# EAGLE design payloaduplink (EAGLE 9.6.2)

## Sheet 1 of 2
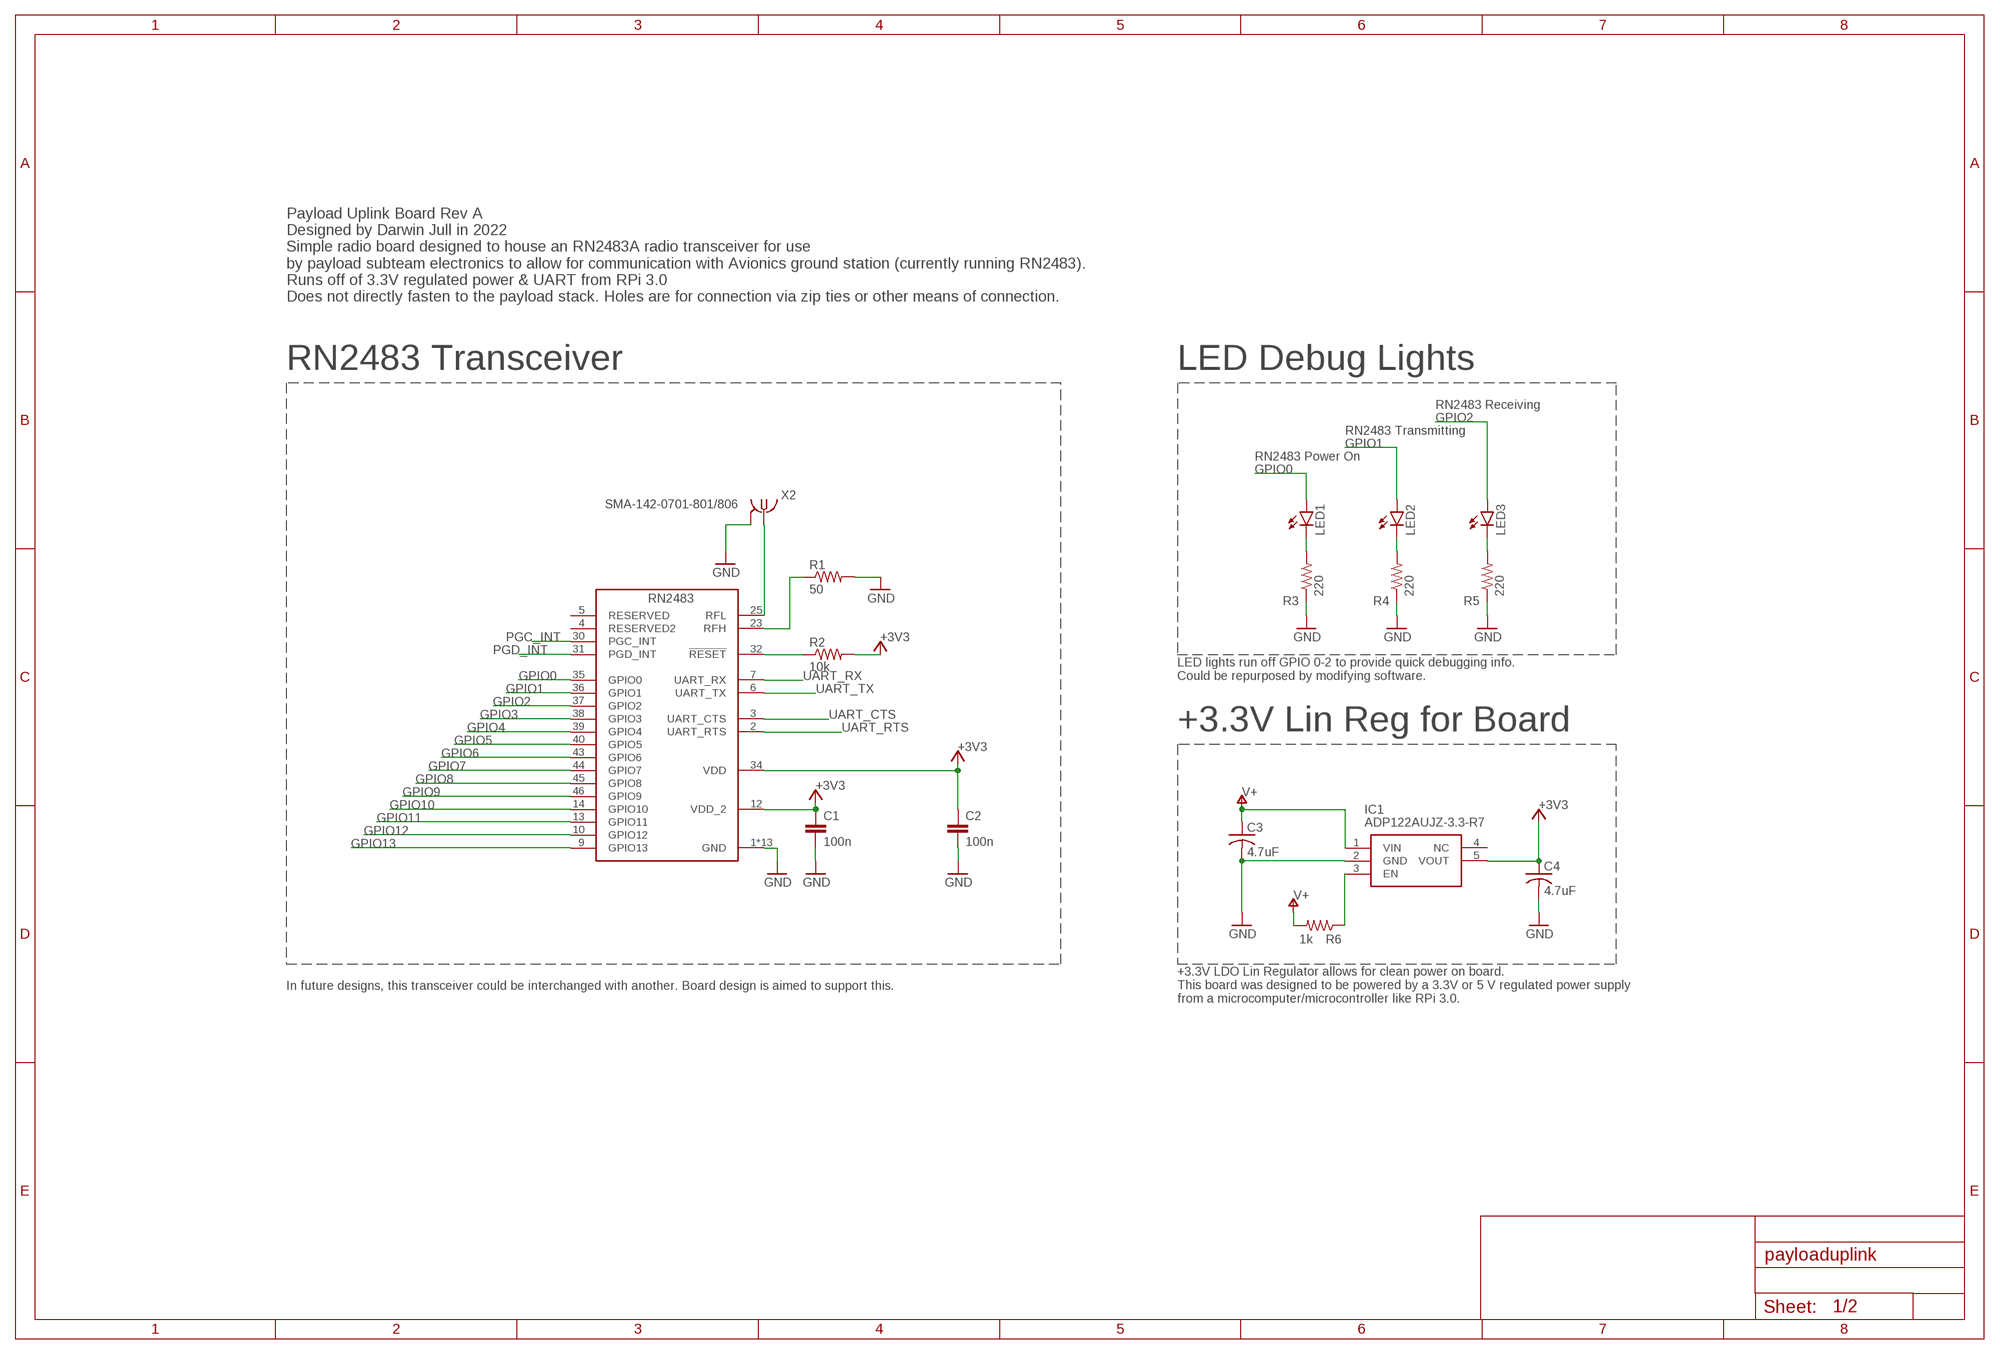
[diagram p0: schematic, sheet 1]

### Parts
C1  100n  C-EUC0805  [C0805]
C2  100n  C-EUC0805  [C0805]
C3  4.7uF  C-USC0805  [C0805]
C4  4.7uF  C-USC0805  [C0805]
IC1  ADP122AUJZ-3.3-R7  [SOT95P280X100-5N]
LED1  LEDCHIPLED_0603  [CHIPLED_0603]
LED2  LEDCHIPLED_0603  [CHIPLED_0603]
LED3  LEDCHIPLED_0603  [CHIPLED_0603]
R1  50  R-US_R0402  [R0402]
R2  10k  R-US_R0805  [R0805]
R3  220  R-US_R0805  [R0805]
R4  220  R-US_R0805  [R0805]
R5  220  R-US_R0805  [R0805]
R6  1k  R-US_R0805  [R0805]
U$1  RN2483_TRANSCIEVER  [RN2483]
X2  SMA-142-0701-801/806  [J502-ND-142-0701-801/806]

### Nets
+3V3 [PWR]: C1.1 C2.1 C4.1 IC1.5(VOUT) R2.2 U$1.12(VDD_2) U$1.34(VDD)
GND [GND]: C1.2 C2.2 C3.2 C4.2 IC1.2(GND) R1.2 R3.1 R4.1 R5.1 U$1.1(GND) U$1.8(GND) U$1.11(GND) U$1.20(GND) U$1.21(GND) U$1.22(GND) U$1.24(GND) U$1.26(GND) U$1.27(GND) U$1.28(GND) U$1.33(GND) U$1.41(GND) U$1.47(GND) X2.G@1 X2.G@2 X2.G@3 X2.G@4 ; also sheet 2
GPIO0 [DATA]: LED1.A U$1.35(GPIO0)
GPIO1 [DATA]: LED2.A U$1.36(GPIO1)
GPIO2 [DATA]: LED3.A U$1.37(GPIO2)
GPIO3 [DATA]: U$1.38(GPIO3) ; also sheet 2
GPIO4 [DATA]: U$1.39(GPIO4) ; also sheet 2
GPIO5 [DATA]: U$1.40(GPIO5) ; also sheet 2
GPIO6 [DATA]: U$1.43(GPIO6) ; also sheet 2
GPIO7 [DATA]: U$1.44(GPIO7) ; also sheet 2
GPIO8 [DATA]: U$1.45(GPIO8) ; also sheet 2
GPIO9 [DATA]: U$1.46(GPIO9) ; also sheet 2
GPIO10 [DATA]: U$1.14(GPIO10) ; also sheet 2
GPIO11 [DATA]: U$1.13(GPIO11) ; also sheet 2
GPIO12 [DATA]: U$1.10(GPIO12) ; also sheet 2
GPIO13 [DATA]: U$1.9(GPIO13) ; also sheet 2
N$1 [ANT]: U$1.25(RFL) X2.1
N$2 [ANT]: R1.1 U$1.23(RFH)
N$3 [DATA]: LED1.C R3.2
N$4 [DATA]: LED2.C R4.2
N$5 [DATA]: LED3.C R5.2
N$7 [DATA]: R2.1 U$1.32(!RESET)
N$8: IC1.3(EN) R6.1
PGC_INT [DATA]: U$1.30(PGC_INT) ; also sheet 2
PGD_INT [DATA]: U$1.31(PGD_INT) ; also sheet 2
UART_CTS [DATA]: U$1.3(UART_CTS) ; also sheet 2
UART_RTS [DATA]: U$1.2(UART_RTS) ; also sheet 2
UART_RX [DATA]: U$1.7(UART_RX) ; also sheet 2
UART_TX [DATA]: U$1.6(UART_TX) ; also sheet 2
V+: C3.1 IC1.1(VIN) R6.2 ; also sheet 2
Unconnected: IC1.4(NC) U$1.4(RESERVED2) U$1.5(RESERVED)

### Notes on the sheet
- Payload Uplink Board Rev A
  Designed by Darwin Jull in 2022
  Simple radio board designed to house an RN2483A radio transceiver for use
  by payload subteam electronics to allow for communication with Avionics ground station (currently running RN2483). 
  Runs off of 3.3V regulated power & UART from RPi 3.0
  Does not directly fasten to the payload stack. Holes are for connection via zip ties or other means of connection.
- RN2483 Transceiver | LED Debug Lights
- RN2483 Receiving
- RN2483 Transmitting
- RN2483 Power On
- LED lights run off GPIO 0-2 to provide quick debugging info. 
  Could be repurposed by modifying software.
- +3.3V Lin Reg for Board
- In future designs, this transceiver could be interchanged with another. Board design is aimed to support this.
- +3.3V LDO Lin Regulator allows for clean power on board. 
  This board was designed to be powered by a 3.3V or 5 V regulated power supply
  from a microcomputer/microcontroller like RPi 3.0.

## Sheet 2 of 2
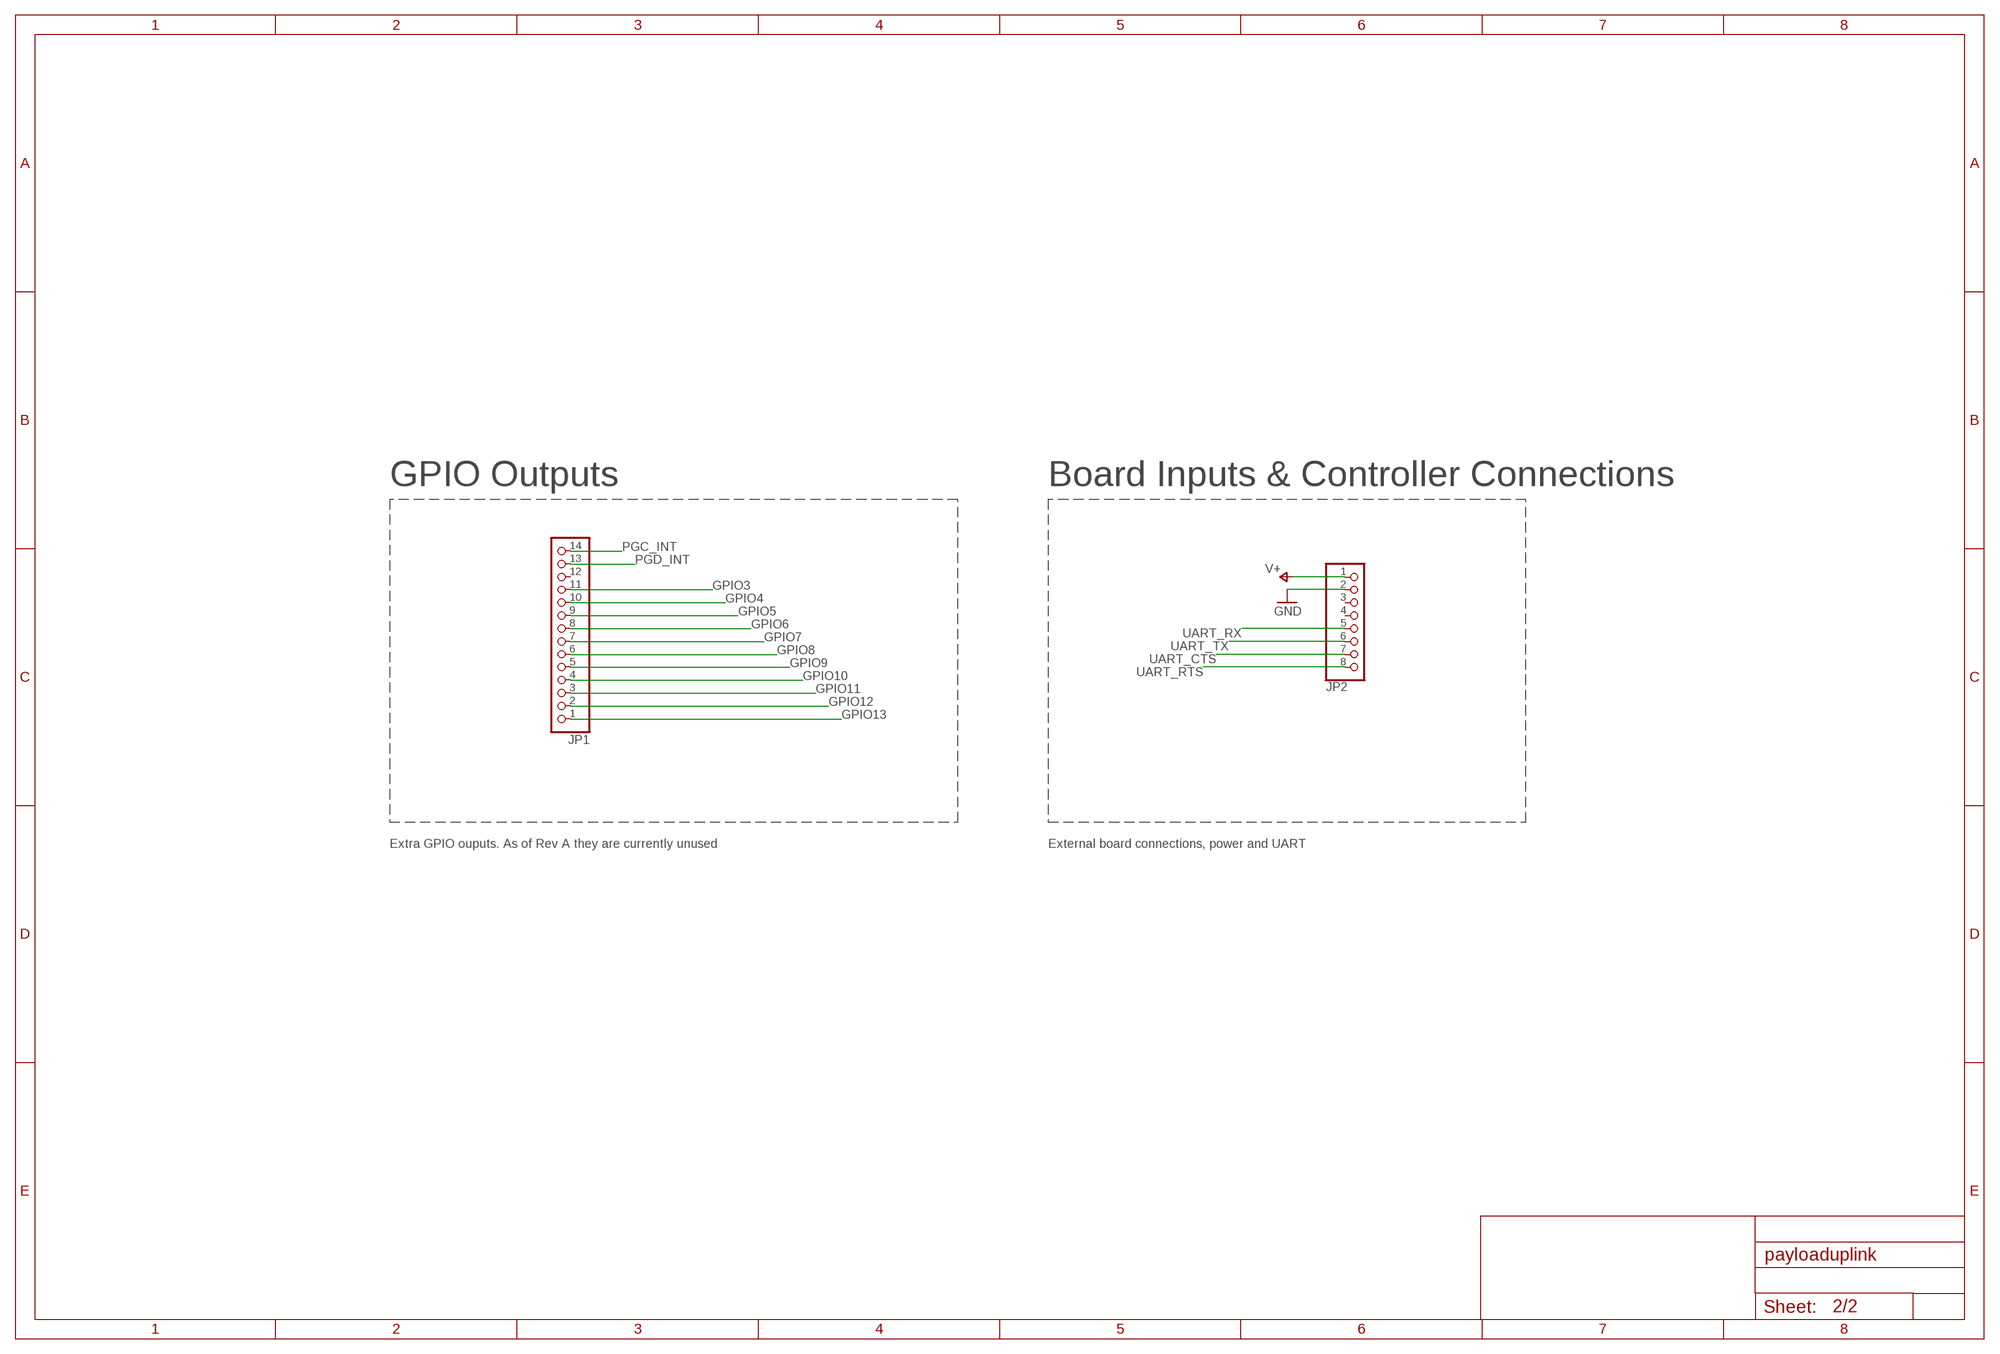
[diagram p1: schematic, sheet 2]

### Parts
JP1  PINHD-1X14  [1X14]
JP2  PINHD-1X8  [1X08]

### Nets
GND [GND]: JP2.2 ; also sheet 1
GPIO3 [DATA]: JP1.11 ; also sheet 1
GPIO4 [DATA]: JP1.10 ; also sheet 1
GPIO5 [DATA]: JP1.9 ; also sheet 1
GPIO6 [DATA]: JP1.8 ; also sheet 1
GPIO7 [DATA]: JP1.7 ; also sheet 1
GPIO8 [DATA]: JP1.6 ; also sheet 1
GPIO9 [DATA]: JP1.5 ; also sheet 1
GPIO10 [DATA]: JP1.4 ; also sheet 1
GPIO11 [DATA]: JP1.3 ; also sheet 1
GPIO12 [DATA]: JP1.2 ; also sheet 1
GPIO13 [DATA]: JP1.1 ; also sheet 1
PGC_INT [DATA]: JP1.14 ; also sheet 1
PGD_INT [DATA]: JP1.13 ; also sheet 1
UART_CTS [DATA]: JP2.7 ; also sheet 1
UART_RTS [DATA]: JP2.8 ; also sheet 1
UART_RX [DATA]: JP2.5 ; also sheet 1
UART_TX [DATA]: JP2.6 ; also sheet 1
V+: JP2.1 ; also sheet 1
Unconnected: JP1.12 JP2.3 JP2.4

### Notes on the sheet
- GPIO Outputs | Board Inputs & Controller Connections
- Extra GPIO ouputs. As of Rev A they are currently unused | External board connections, power and UART

## Library data of the parts
C1 C2 = rcl:C-EU: CAPACITOR, European symbol; SPICEPREFIX: C
C3 C4 = rcl:C-US: CAPACITOR, American symbol; SPICEPREFIX: C
IC1 = ADP122AUJZ-3.3-R7:ADP122AUJZ-3.3-R7: Linear Voltage Regulators 5.5V Input 300mA Low Quiescent Crnt CMOS Source: Datasheet <http://www.analog.com/media/en/technical-documentation/data-sheets/ADP122_123.pdf>; DESCRIPTION: Linear Voltage Regulators 5.5V Input 300mA Low Quiescent Crnt CMOS; HEIGHT: 1mm; MANUFACTURER_NAME: Linear Technology; MANUFACTURER_PART_NUMBER: ADP122AUJZ-3.3-R7; MOUSER_PART_NUMBER: 584-ADP122AUJZ-3.3R7; MOUSER_PRICE-STOCK: https://www.mouser.com/Search/Refine.aspx?Keyword=584-ADP122AUJZ-3.3R7
JP1 = pinhead:PINHD-1X14: PIN HEADER
JP2 = pinhead:PINHD-1X8: PIN HEADER
LED1-LED3 = led:LED: LED OSRAM: - CHIPLED LG R971, LG N971, LY N971, LG Q971, LY Q971, LO R971, LY R971 LH N974, LH R974 LS Q976, LO Q976, LY Q976 LO Q996 - Hyper CHIPLED LW Q18S LB Q993, LB Q99A, LB R99A - SideLED LS A670, LO A670, LY A670, LG A670, LP A670 LB A673, LV A673, LT A673, LW A673 LH A674 LY A675 LS A676, LA A676, LO A676, LY A676, LW A676 LS A679, LY A679, LG A679 - Hyper Micro SIDELED® LS Y876, LA Y876, LO Y876, LY Y876 LT Y87S - SmartLED LW L88C, LW L88S LB L89C, LB L89S, LG L890 LS L89K, LO L89K, LY L89K LS L896, LA L896, LO L896, LY L896 - TOPLED LS T670, LO T670, LY T670, LG T670, LP T670 LSG T670, LSP T670, LSY T670, LOP T670, LYG T670 LG T671, LOG T671, LSG T671 LB T673, LV T673, LT T673, LW T673 LH T674 LS T676, LA T676, LO T676, LY T676, LB T676, LH T676, LSB T676, LW T676 LB T67C, LV T67C, LT T67C, LS T67K, LO T67K, LY T67K, LW E67C LS E67B, LA E67B, LO E67B, LY E67B, LB E67C, LV E67C, LT E67C LW T67C LS T679, LY T679, LG T679 LS T770, LO T770, LY T770, LG T770, LP T770 LB T773, LV T773, LT T773, LW T773 LH T774 LS E675, LA E675, LY E675, LS T675 LS T776, LA T776, LO T776, LY T776, LB T776 LHGB T686 LT T68C, LB T68C - Hyper Mini TOPLED® LB M676 - Mini TOPLED Santana® LG M470 LS M47K, LO M47K, LY M47K Source: http://www.osram.convergy.de LUXEON: - LUMILED® LXK2-PW12-R00, LXK2-PW12-S00, LXK2-PW14-U00, LXK2-PW14-V00 LXK2-PM12-R00, LXK2-PM12-S00, LXK2-PM14-U00 LXK2-PE12-Q00, LXK2-PE12-R00, LXK2-PE12-S00, LXK2-PE14-T00, LXK2-PE14-U00 LXK2-PB12-K00, LXK2-PB12-L00, LXK2-PB12-M00, LXK2-PB14-N00, LXK2-PB14-P00, LXK2-PB14-Q00 LXK2-PR12-L00, LXK2-PR12-M00, LXK2-PR14-Q00, LXK2-PR14-R00 LXK2-PD12-Q00, LXK2-PD12-R00, LXK2-PD12-S00 LXK2-PH12-R00, LXK2-PH12-S00 LXK2-PL12-P00, LXK2-PL12-Q00, LXK2-PL12-R00 Source: www.luxeon.com KINGBRIGHT: KA-3528ASYC Source: www.kingbright.com
R1-R6 = rcl:R-US_: RESISTOR, American symbol; SPICEPREFIX: R
U$1 = DJCUINSPACEV1:RN2483_TRANSCIEVER
X2 = con-coax:SMA-: SMA 50 Ohm End Launch Jack Receptacle - Round Contact Johnson Components Source: www.johnsoncomponents.com .. J502-ND.pdf; MF: JOHNSON COMPONENTS; MPN: 142-0701-801; OC_FARNELL: 1608592; OC_NEWARK: 90F2624

## Board
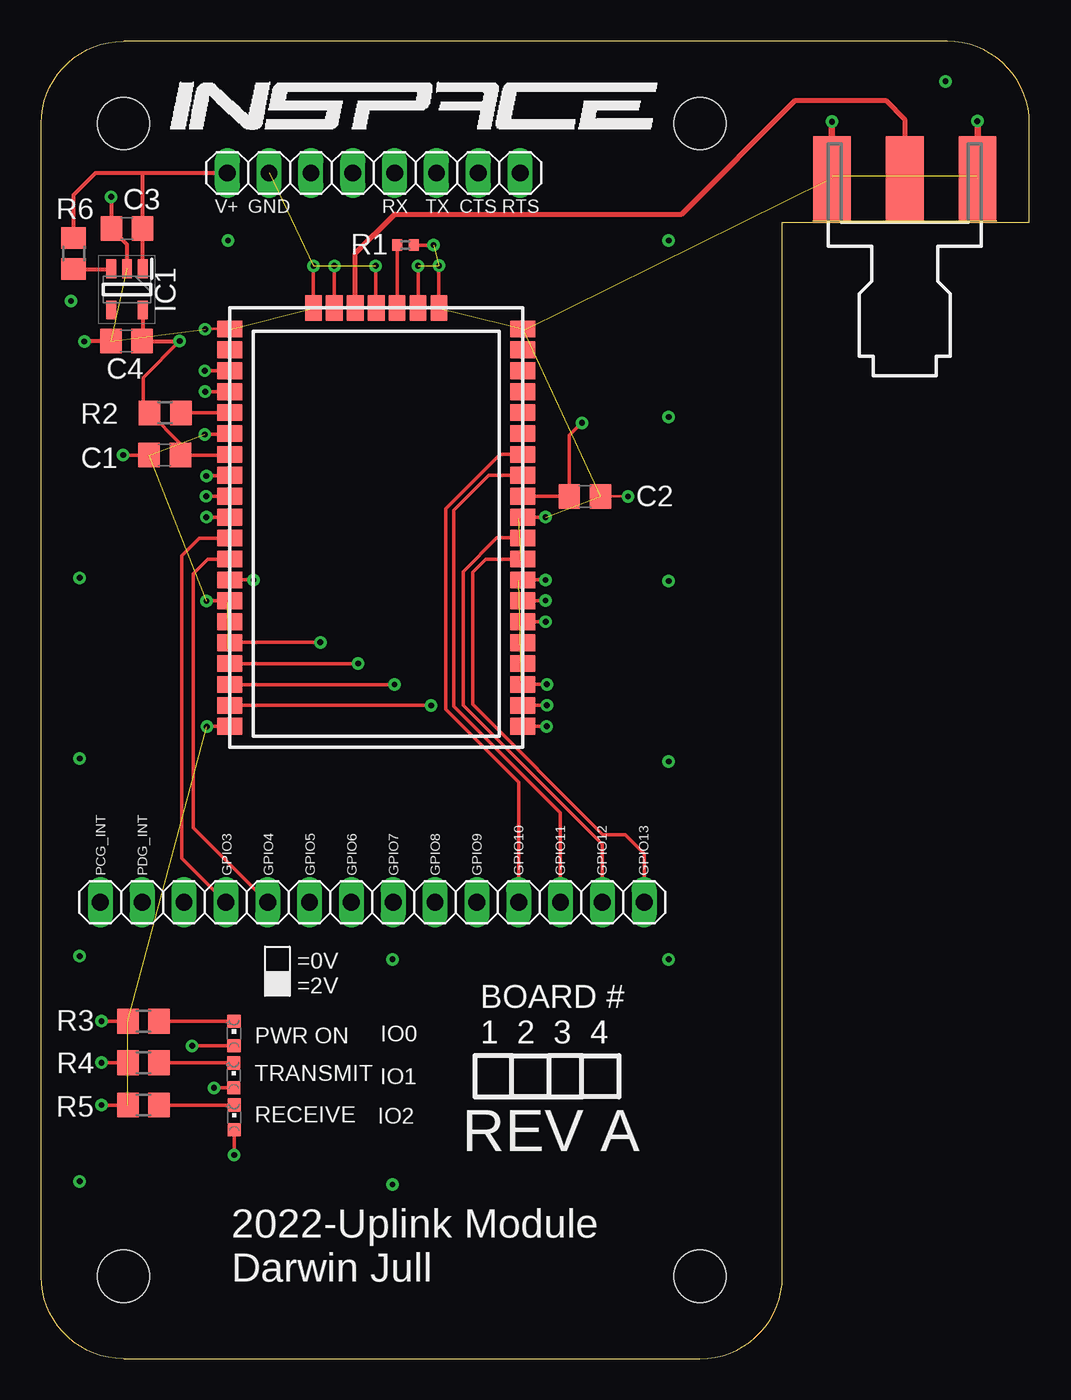
[diagram p2: board, top side]
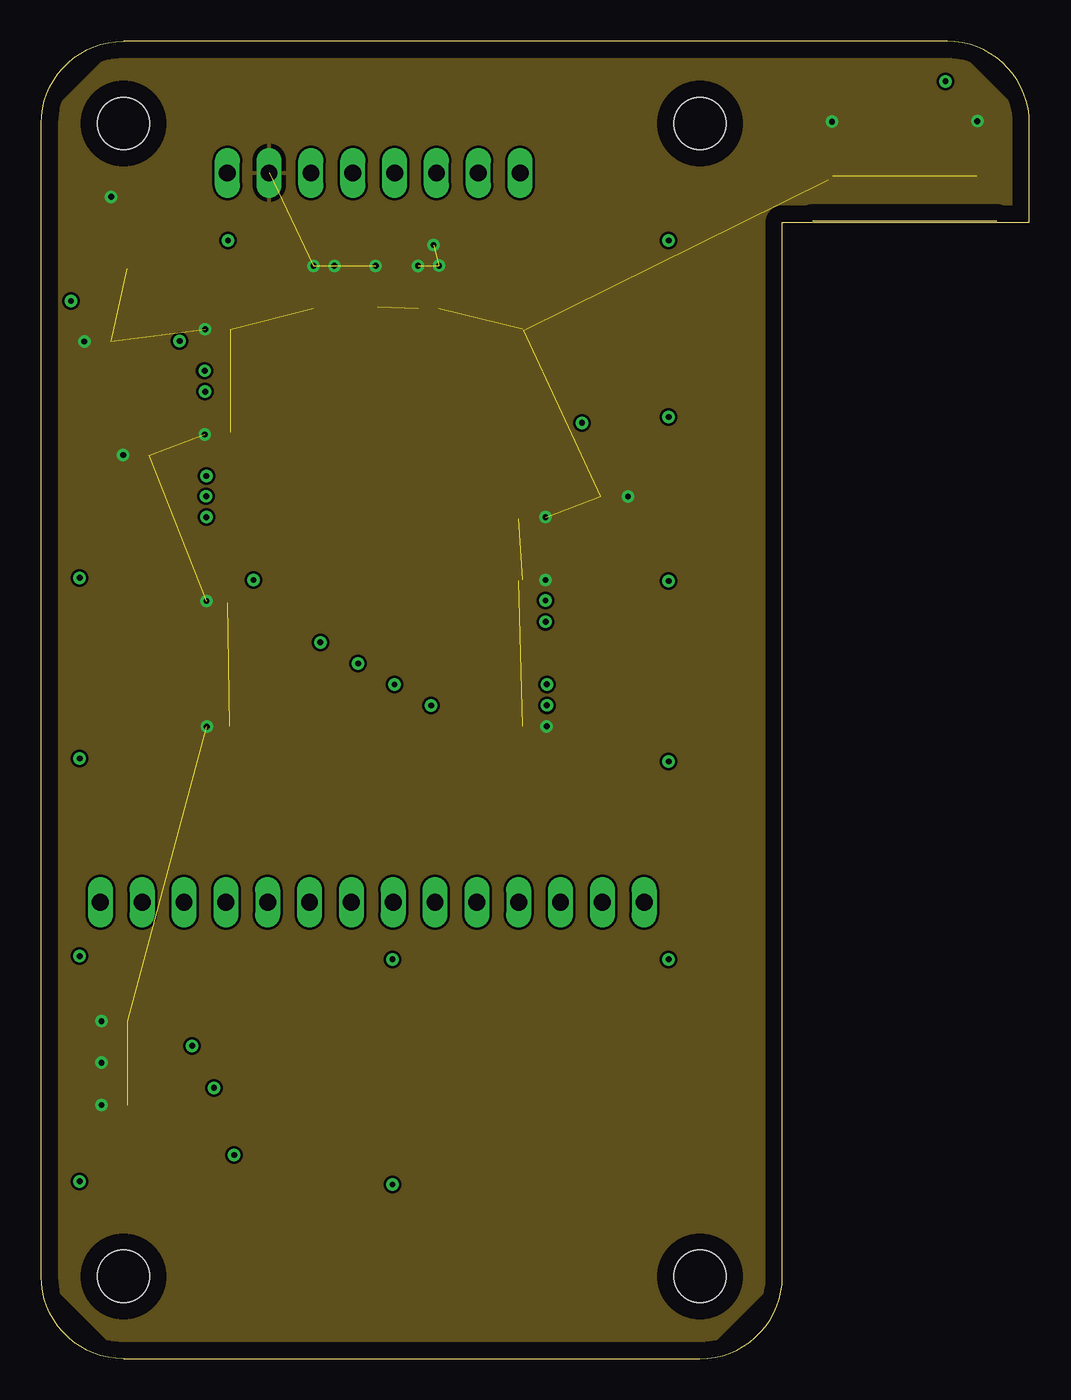
[diagram p3: board, inner layer Route2]
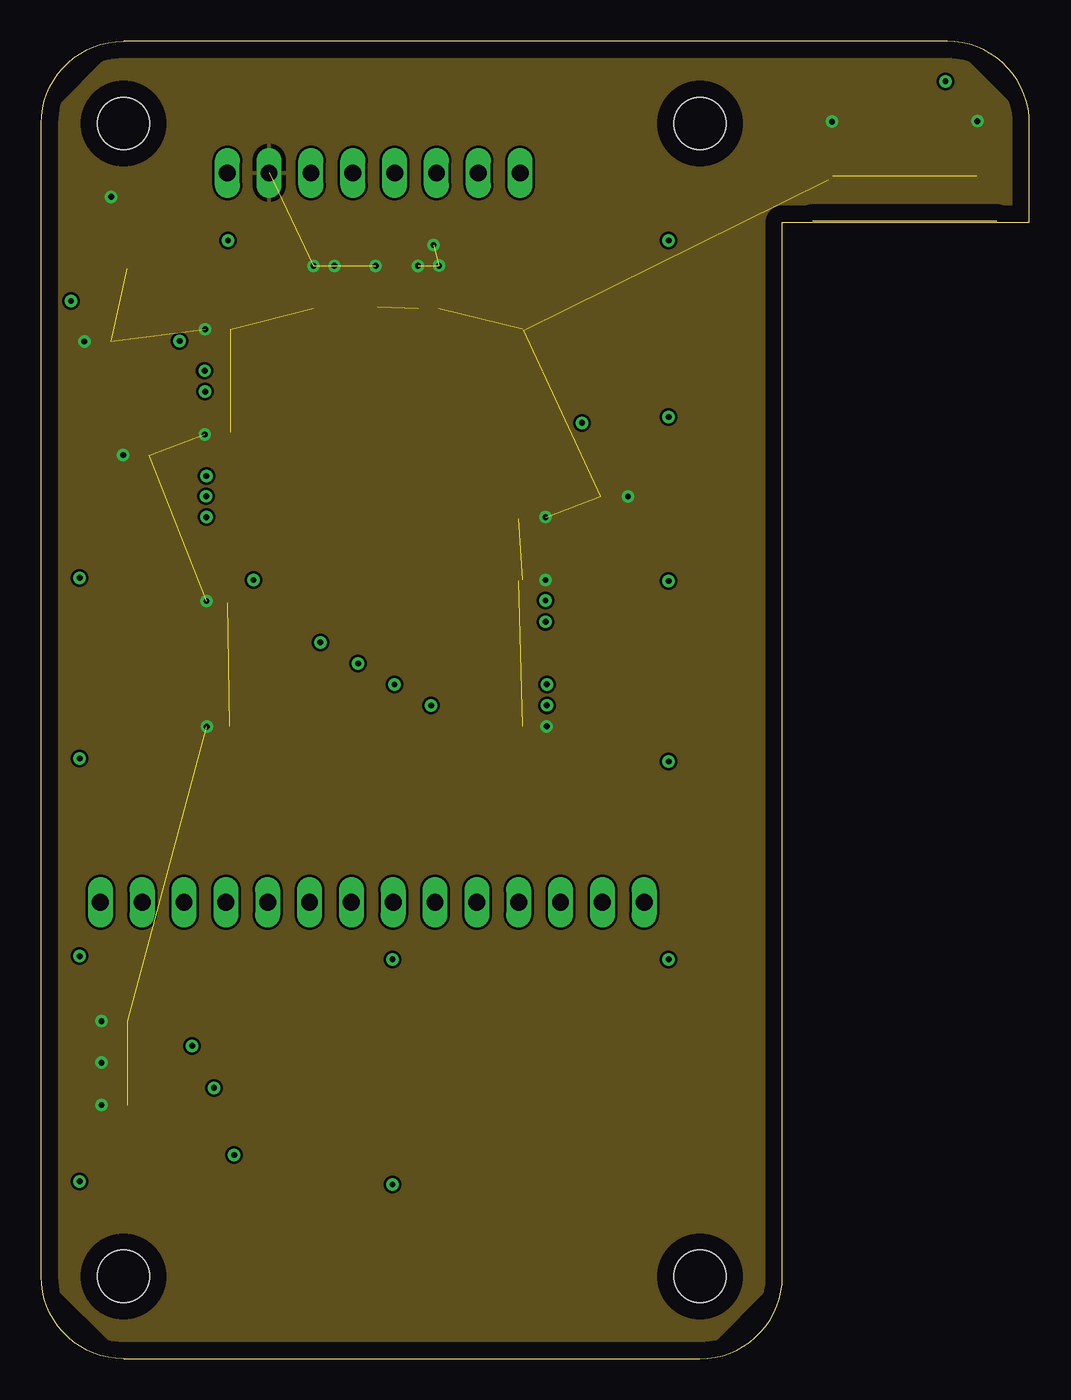
[diagram p4: board, inner layer Route15]
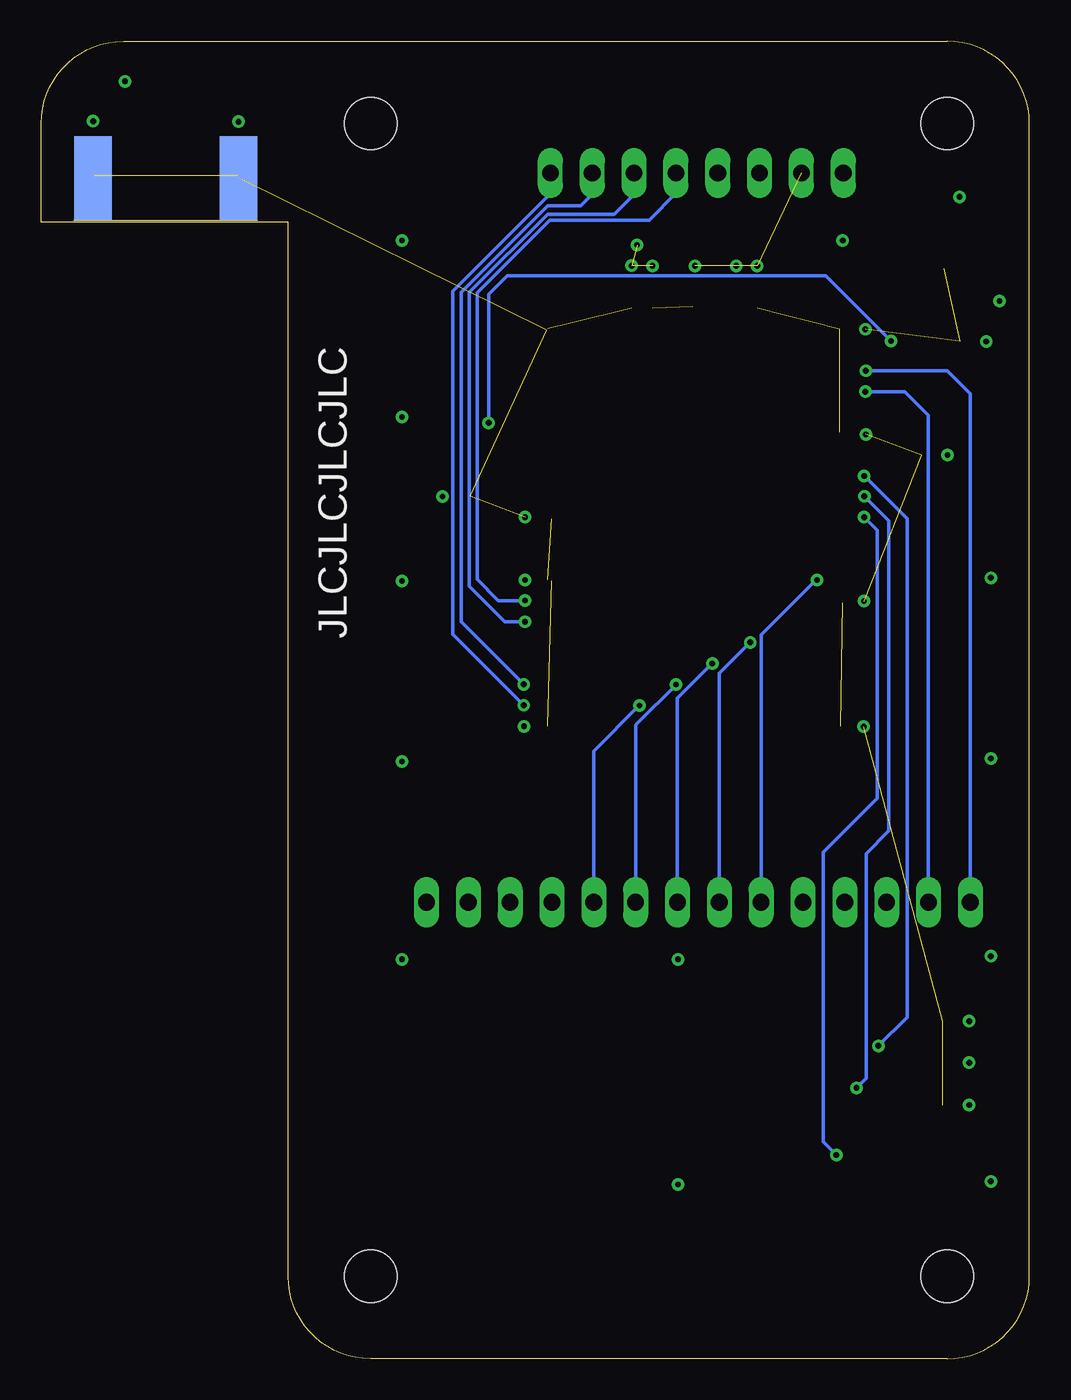
[diagram p5: board, bottom side, seen from below]

Size 60 x 80 mm. Coordinates in mm from the lower left corner, seen from the top.
Outline: 0,5 0,75 arc-90 5,80 55,80 arc-90 60,75 60,69 45,69 45,5 arc-90 40,0 5,0 arc-90 0,5
Copper layers (1+2*15+16): Top 0.035mm / dielectric 0.2mm / Route2 0.0175mm / dielectric 1.065mm / Route15 0.0175mm / dielectric 0.2mm / Bottom 0.035mm
Design rules "CUINSPACE_Design Rules *": minimum track width 6mil, minimum drill 0.35mm, track to track 6mil, track to pad 6mil, pad to pad 6mil, via to via 6mil, smd to smd 6mil, copper to edge 40mil, drill to drill 6mil, minimum pad ring 10mil, minimum via ring 8mil, stop-mask expansion 4mil, vias tented up to drill 0mil, thermal gap 10mil
Holes 3.17 mm at 5,5 40,5 5,75 40,75

### Footprints (pad centres in the part's own frame; a part is rotated, then mirrored left to right if it is on the bottom)
C0805 = smd 1.3 x 1.5: 1 -0.95,0; 2 0.95,0
SOT95P280X100-5N = smd 1.15 x 0.6: 1 -1.25,0.95; 2 -1.25,0; 3 -1.25,-0.95; 4 1.25,-0.95; 5 1.25,0.95
1X14 = drill 1.016 long: 1 -16.51,0; 2 -13.97,0; 3 -11.43,0; 4 -8.89,0; 5 -6.35,0; 6 -3.81,0; 7 -1.27,0; 8 1.27,0; 9 3.81,0; 10 6.35,0; 11 8.89,0; 12 11.43,0; 13 13.97,0; 14 16.51,0
1X08 = drill 1.016 long: 1 -8.89,0; 2 -6.35,0; 3 -3.81,0; 4 -1.27,0; 5 1.27,0; 6 3.81,0; 7 6.35,0; 8 8.89,0
CHIPLED_0603 = smd 0.8 x 0.8: A 0,-0.75; C 0,0.75
R0402 = smd 0.6 x 0.7: 1 -0.5,0; 2 0.5,0
R0805 = smd 1.3 x 1.5: 1 -0.95,0; 2 0.95,0
RN2483 = smd 1.524 x 1.016: 1 17.78,1.27; 2 17.78,2.54; 3 17.78,3.81; 4 17.78,5.08; 5 17.78,6.35; 6 17.78,7.62; 7 17.78,8.89; 8 17.78,10.16; 9 17.78,11.43; 10 17.78,12.7; 11 17.78,13.97; 12 17.79,15.24; 13 17.78,16.51; 14 17.78,17.78; 15 17.78,19.05; 16 17.78,20.32; 17 17.78,21.59; 18 17.78,22.86; 19 17.78,24.13; 20 17.78,25.4; 28 0,25.4; 29 0,24.13; 30 0,22.86; 31 0,21.59; 32 0,20.32; 33 0,19.05; 34 0,17.78; 35 0,16.51; 36 0.01,15.24; 37 0,13.97; 38 0,12.7; 39 0,11.43; 40 0,10.16; 41 0,8.89; 42 0,7.62; 43 0,6.35; 44 0,5.08; 45 0,3.81; 46 0,2.54; 47 0,1.27 | smd 1.016 x 1.524: 21 12.7,26.67; 22 11.43,26.67; 23 10.16,26.67; 24 8.89,26.67; 25 7.62,26.67; 26 6.35,26.67; 27 5.08,26.67
J502-ND-142-0701-801/806 = smd 5.08 x 2.286: 1 2.565,0; G@1 2.565,4.42; G@2 2.565,-4.42 | smd 5.08 x 2.286 bottom: G@3 2.565,4.42; G@4 2.565,-4.42

### Placement (x,y rotation side)
C1  7.5,54.87 180 top
C2  33.01,52.36 0 top
C3  5.21,68.62 180 top
C4  5.18,61.79 180 top
IC1  5.21,64.93 270 top
JP1  20.1,27.72 180 top
JP2  20.19,72 0 top
LED1  11.71,19.75 0 top
LED2  11.7,17.21 0 top
LED3  11.72,14.66 0 top
R1  22.11,67.62 0 top
R2  7.53,57.43 180 top
R3  6.21,20.5 0 top
R4  6.21,17.98 0 top
R5  6.21,15.41 0 top
R6  1.97,67.11 90 top
U$1  11.45,37.13 0 top
U$2  [INSPACE_3CM_LETTERS]  7.52,74.28 0 top
X2  52.43,69.11 90 top

### Tracks (layer width: path | path; a pad name or v marks a point on that pad's centre or on a via)
+3V3  (via drill 0.35)
  Top 0.2: v8.41,61.8 6.19,59.58 6.19,57.82 R2.2 8.45,55.56 C1.1 11.41,54.87 U$1.34 | v32.83,56.83 32.06,56.06 32.06,54.41 C2.1 U$1.12
  Top 0.254: IC1.5 6.16,61.82 C4.1 v8.4,61.79 v8.41,61.8
  Bottom 0.2: v32.83,56.83 32.83,64.64 31.71,65.76 12.37,65.76 v8.41,61.8
GND  (via drill 0.35, 0.35 pad 0.6)  (25 unrouted)
  Top 0.152: 11.5,38.25 U$1.47 | 56.8,71.83 X2.G@4 | 29,47.25 U$1.8 | 29,51 U$1.11 | 47.8,71.58 X2.G@3 48.05,71.83 | 11.5,56.25 U$1.33 | 11.5,62.5 U$1.28 9.98,62.53 v9.96,62.51 | v10.05,46.02 v10.04,46.01 | 10.08,38.4 v10.06,38.38 | 11.42,56.15 11.39,56.12 | v35.63,52.36 C2.2 | U$1.24 20.32,63.82 | 20.32,66.28 20.31,66.29 v20.31,66.36
  Top 0.2: 29.31,62.45 U$1.20 | 11.32,45.89 U$1.41 v10.05,46.02 | U$1.33 11.42,56.15 | 6.01,54.87 C1.2 v4.98,54.87 | 20.43,63.89 U$1.24 | R5.1 v3.66,15.41 | U$1.47 10.08,38.4 | 11.39,56.12 v9.93,56.12 | v16.53,66.36 U$1.27 | U$1.11 v30.62,51.1 | U$1.8 v30.62,47.29 | U$1.1 v30.69,38.4 | U$1.26 v17.8,66.36 | 20.32,66.28 20.32,63.82 | U$1.22 v22.88,66.36 | U$1.21 v24.15,66.37 | R3.1 v3.66,20.5 | R4.1 v3.66,17.98 | R1.2 v23.82,67.62
  Top 0.254: IC1.2 5.21,67.67 C3.2 v4.26,70.54 v4.25,70.55 | C4.2 2.64,61.79 v2.62,61.77
  Top 0.406: X2.G@3 v48.01,75.1 v48.02,75.11 | X2.G@4 v56.85,75.13 v56.84,75.14
  Bottom 0.152: 48.05,71.83 X2.G@3 | 56.8,71.83 X2.G@4
  pour Route2: 0.17,75.21 4.8,79.84 4.8,79.86 55.2,79.86 59.87,75.19 59.87,69.13 44.86,69.13 44.85,69.12 44.85,5.01 39.99,0.15 39.99,0.14 5.05,0.14 0.17,5.02 0.17,75.19 0.18,75.2
  pour Route15: 0.19,75.18 4.81,79.8 4.81,79.82 55.19,79.82 55.2,79.83 59.83,75.2 59.84,75.2 59.84,69.17 59.83,69.16 44.84,69.16 44.83,69.15 44.83,5.01 44.82,5 39.98,0.16 39.97,0.16 5.09,0.16 0.2,5.05 0.17,5.05 0.17,16.84 0.17,75.15 0.18,75.16
GPIO0  (via drill 0.35, 0.35 pad 0.6)
  Top 0.152: U$1.35 11.41,53.6
  Top 0.2: 11.41,53.6 v10.03,53.6 | v9.17,19 LED1.A
  Bottom 0.2: v10.03,53.6 7.42,50.99 7.42,20.75 v9.17,19
GPIO1  (via drill 0.35, 0.35 pad 0.6)
  Top 0.152: LED2.A
  Top 0.2: U$1.36 v10.02,52.37 | v10.5,16.45 LED2.A
  Bottom 0.152: v10.02,52.37 v10.01,52.37
  Bottom 0.2: v10.02,52.37 8.53,50.88 8.53,32.06 9.92,30.67 9.92,17.03 v10.5,16.45
GPIO2  (via drill 0.35, 0.35 pad 0.6)
  Top 0.2: U$1.37 v10.03,51.1 | v11.72,12.38 LED3.A
  Bottom 0.2: v10.03,51.1 9.24,50.31 9.24,34.04 12.52,30.76 12.52,13.18 v11.72,12.38
GPIO3
  Top 0.2: U$1.38 9.59,49.83 8.53,48.77 8.53,30.4 JP1.11
GPIO4
  Top 0.2: U$1.39 10.12,48.56 9.24,47.68 9.24,32.23 JP1.10
GPIO5  (via drill 0.35 pad 0.6)
  Top 0.2: U$1.40 v12.89,47.29
  Bottom 0.152: v12.89,47.29 12.95,47.29
  Bottom 0.2: 12.95,47.29 16.29,43.95 JP1.9
GPIO6  (via drill 0.35 pad 0.6)
  Top 0.2: U$1.43 11.47,43.5 v16.95,43.5
  Bottom 0.2: v16.95,43.5 18.83,41.62 JP1.8
GPIO7  (via drill 0.35 pad 0.6)
  Top 0.152: v19.24,42.21 v19.25,42.22
  Top 0.2: U$1.44 v19.24,42.21
  Bottom 0.2: v19.25,42.22 21.37,40.1 JP1.7
GPIO8  (via drill 0.35 pad 0.6)
  Top 0.2: U$1.45 v21.45,40.94
  Bottom 0.2: v21.45,40.94 23.84,38.55 23.91,38.48 JP1.6
GPIO9  (via drill 0.35 pad 0.6)
  Top 0.2: U$1.46 v23.68,39.67
  Bottom 0.2: v23.68,39.67 26.45,36.9 JP1.5
GPIO10
  Top 0.152: U$1.14
  Top 0.2: U$1.14 27.86,54.92 24.57,51.62 24.57,39.44 28.99,35.02 JP1.4
GPIO11
  Top 0.152: U$1.13
  Top 0.2: U$1.13 27.17,53.65 25.05,51.52 25.05,39.61 31.52,33.15 | 31.52,33.15 31.53,33.13 | 31.52,33.15 31.52,27.73 JP1.3
GPIO12
  Top 0.152: U$1.10
  Top 0.2: U$1.10 27.67,49.84 25.64,47.8 25.64,39.67 34.07,31.24 JP1.2
GPIO13
  Top 0.2: U$1.9 26.99,48.56 26.19,47.76 26.19,39.73 34.11,31.81 35.46,31.81 36.61,30.66 JP1.1
N$1
  Top 0.293: U$1.25 19.07,67.11 21.46,69.5 38.89,69.5 45.79,76.4 51.27,76.4 52.43,75.24 X2.1
N$2
  Top 0.2: R1.1 U$1.23
N$3
  Top 0.2: R3.2 LED1.C
N$4
  Top 0.152: 11.68,17.98 LED2.C
  Top 0.2: 11.68,17.98 R4.2
N$5
  Top 0.2: LED3.C R5.2
N$6  (via drill 0.35)
  other vias: 11.34,67.91
N$7
  Top 0.2: R2.1 11.43,57.43 U$1.32
N$8
  Top 0.254: R6.1 4.24,66.16 IC1.3
N$9  (via drill 0.35)
  other vias: 38.09,67.91
N$10  (via drill 0.35)
  other vias: 38.09,57.18
N$11  (via drill 0.35)
  other vias: 38.09,47.23
N$12  (via drill 0.35)
  other vias: 38.09,36.27
N$13  (via drill 0.35)
  other vias: 38.09,24.25
N$14  (via drill 0.35)
  other vias: 1.81,64.22
N$15  (via drill 0.35)
  other vias: 21.33,24.25
N$16  (via drill 0.35)
  other vias: 2.34,24.45
N$17  (via drill 0.35)
  other vias: 2.34,10.78
N$18  (via drill 0.35)
  other vias: 21.33,10.59
N$19  (via drill 0.35)
  other vias: 2.34,36.45
N$20  (via drill 0.35)
  other vias: 2.34,47.42
N$22  (via drill 0.35)
  other vias: 54.91,77.56
PGC_INT  (via drill 0.35)
  Top 0.2: U$1.30 v9.93,59.99
  Bottom 0.2: v9.93,59.99 4.98,59.99 3.59,58.6 JP1.14
PGD_INT  (via drill 0.35)
  Top 0.2: U$1.31 v9.96,58.72
  Bottom 0.2: v9.96,58.72 7.57,58.72 6.13,57.28 JP1.13
UART_CTS  (via drill 0.35)
  Top 0.152: U$1.3
  Top 0.2: U$1.3 29.26,40.91 | v30.7,40.95 U$1.3
  Bottom 0.2: v30.7,40.95 34.5,44.75 34.5,64.75 29.25,70 27.24,70 27.24,70.01 26.54,70.71 JP2.7
UART_RTS  (via drill 0.35)
  Top 0.152: U$1.2
  Top 0.2: v30.7,39.68 U$1.2
  Bottom 0.2: v30.7,39.68 35,43.98 35,64.82 29.08,70.74 JP2.8
UART_RX  (via drill 0.35)
  Top 0.2: v30.62,46.04 29.25,46.04 U$1.7
  Bottom 0.2: v30.62,46.04 32.25,46.04 33.53,47.32 33.53,64.72 29.11,69.14 23.08,69.14 21.46,70.76 JP2.5
UART_TX  (via drill 0.35)
  Top 0.2: v30.63,44.75 U$1.6
  Bottom 0.2: v30.63,44.75 31.85,44.75 34,46.9 34,64.75 29.25,69.5 25.22,69.5 24,70.72 JP2.6
V+
  Top 0.254: R6.2 1.97,70.67 3.3,72 6.12,72 6.16,71.96 | 6.16,71.96 C3.1 IC1.1 | 6.16,71.96 6.2,72 JP2.1

### Text on the board
tPlace: BOARD # / 1 2 3 4 | REV A | 2022-Uplink Module / Darwin Jull
bPlace: JLCJLCJLCJLC
tNames: V+ | GND | RX | TX | CTS | RTS | PCG_INT | PDG_INT | GPIO3 | GPIO4 | GPIO5 | GPIO6 | GPIO7 | GPIO8 | GPIO9 | GPIO10 | GPIO11 | GPIO12 | GPIO13 | =0V | =2V | PWR ON | IO0 | TRANSMIT | IO1 | RECEIVE | IO2